# Altium project Audio_testboard.PrjPcb (part 2 of 3)
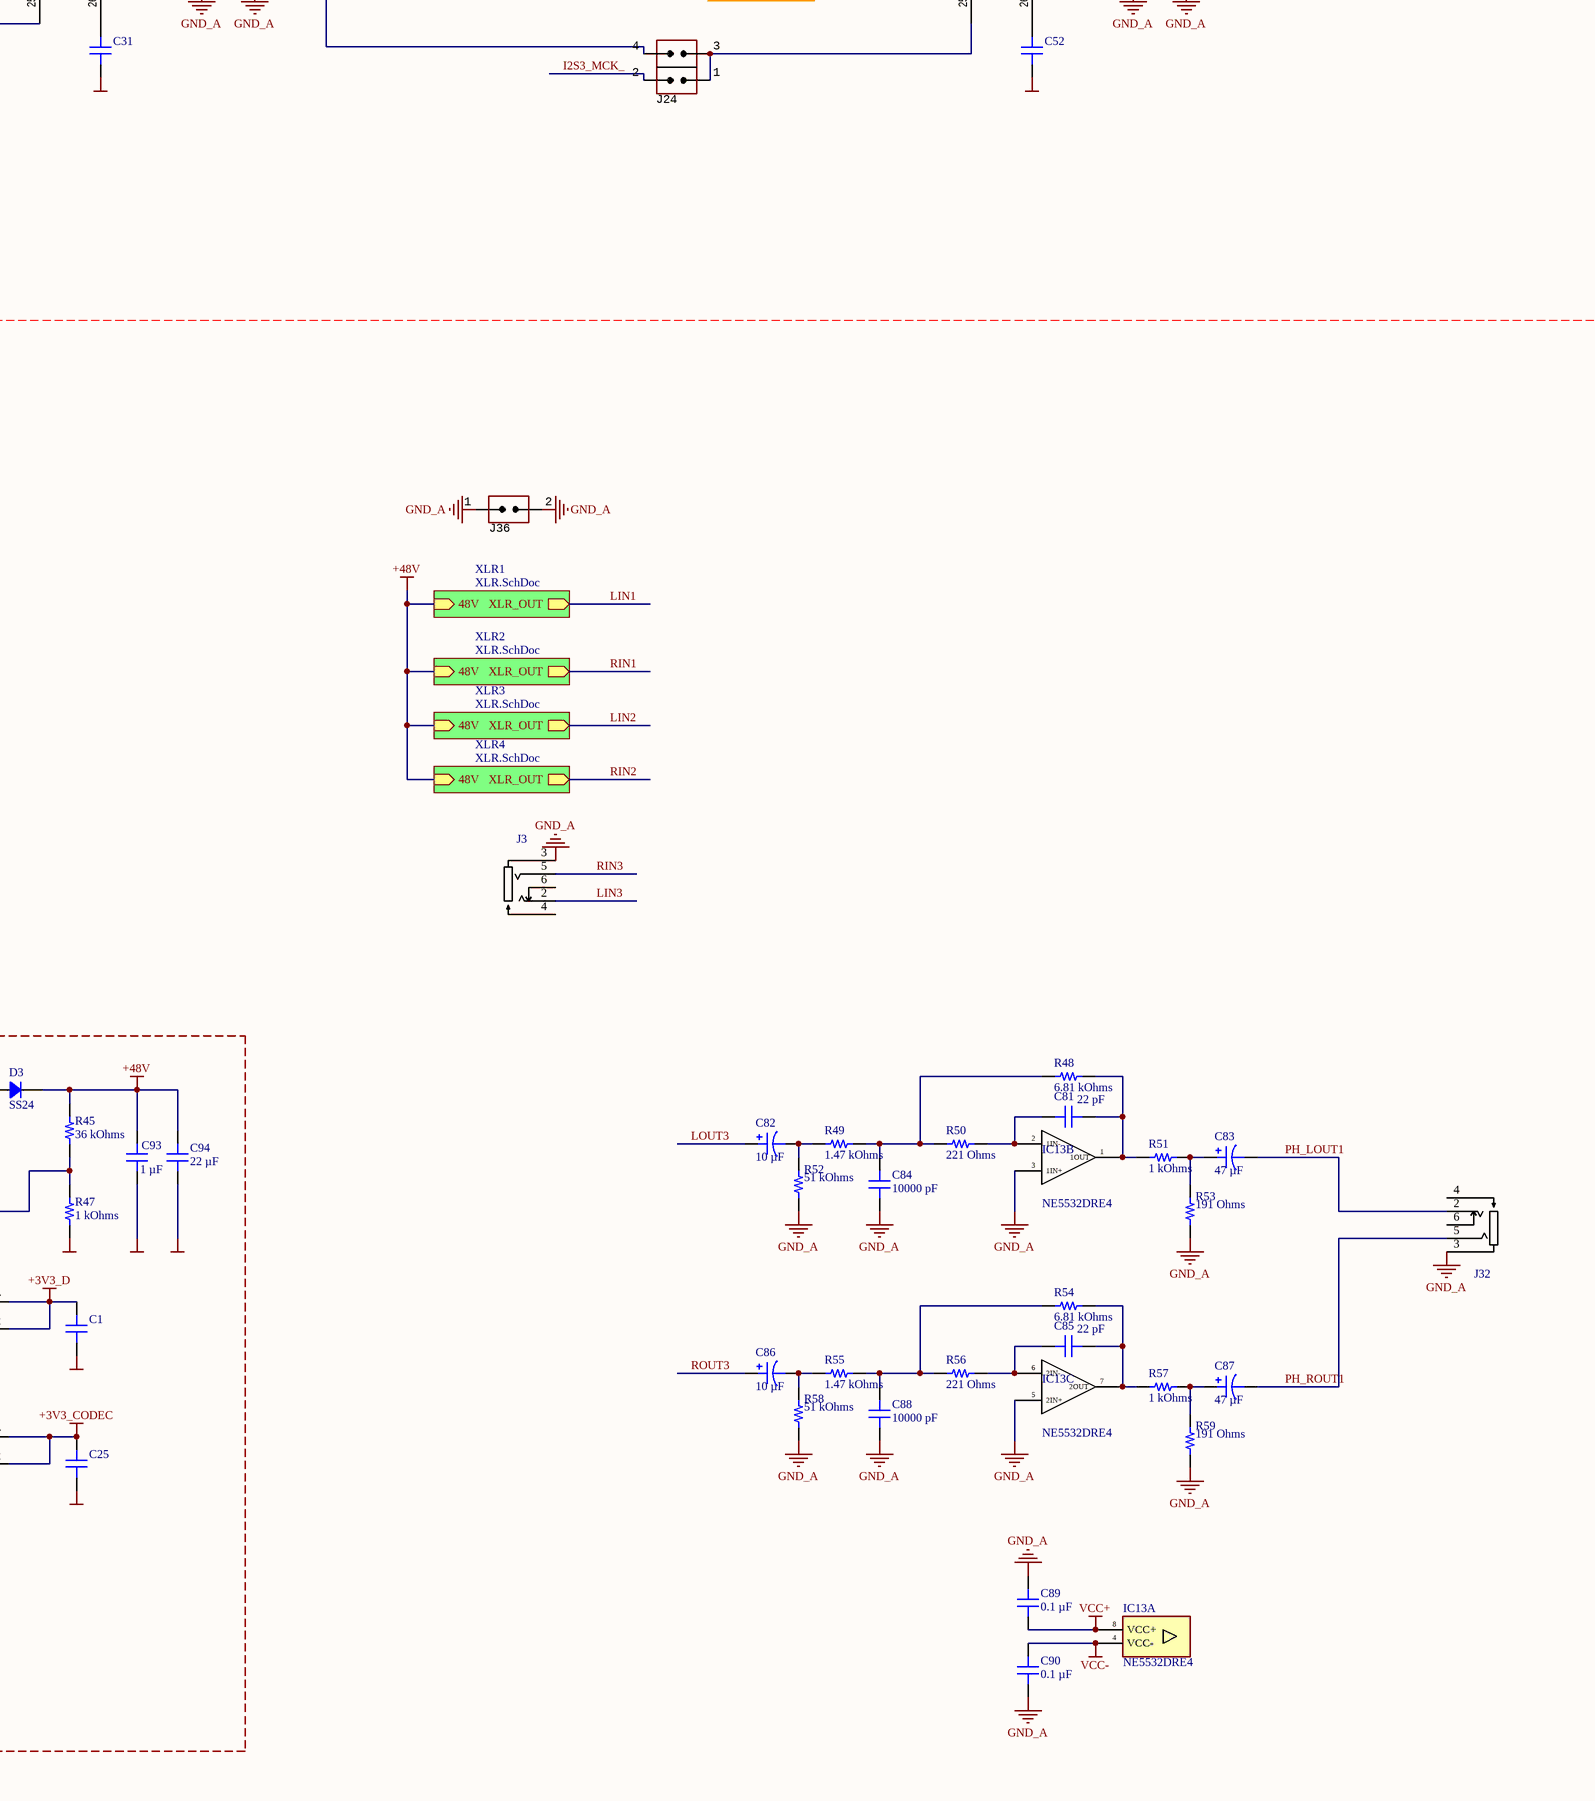
[diagram p7: Audio_testboard.SchDoc, bottom right]

## Sheet Audio_testboard.SchDoc (continued)

### Library data of the parts
C1 C4 C6 C7 C9 C25#2 C28 C30 C41 C42 C51 = LMK212ABJ106KD-T: CAP CER 10UF 10V X5R 0805; manufacturer: Taiyo Yuden; Tolerance: ±10%; Part Number: LMK212ABJ106KD-T; Capacitance: 10 µF; Applications: SMPS Filtering; componentlink1description: Datasheet; componentlink1url: https://www.yuden.co.jp/productdata/catalog/mlcc01_e.pdf; componentlink2description: DigiKey Link; componentlink2url: https://www.digikey.com/en/products/detail/taiyo-yuden/LMK212ABJ106KD-T/4970805; Device Package: 0805 (2012 Metric); lastupdated: 4/6/2026 7:33:15 PM; Lifecycle Status: Active; Minimum Order: 1; Mounting Type: Surface Mount, MLCC; Operating Temperature: -55°C ~ 85°C; Package / Case: 0805 (2012 Metric); packaging: TapeAndReel; partid: 3697; Part Status: Active; price: 0.02; series: M; Size / Dimension: 0.079" L x 0.049" W (2.00mm x 1.25mm); Supplier 1: DigiKey; Supplier Part Number 1: 587-4282-1-ND; Temperature Coefficient: X5R; Thickness (Max): 0.037" (0.95mm); value: 10 µF; Voltage - Rated: 10V
C2 C23#2 = EMK212B7105KGHTR: CAP CER 1UF 16V X7R 0805; manufacturer: Taiyo Yuden; Tolerance: ±10%; Part Number: EMK212B7105KGHTR; Capacitance: 1 µF; Applications: Automotive; componentlink1description: Datasheet; componentlink1url: https://ds.yuden.co.jp/TYCOMPAS/ut/detail?pn=EMK212B7105KGHTR &u=M; componentlink2description: DigiKey Link; componentlink2url: https://www.digikey.com/en/products/detail/taiyo-yuden/EMK212B7105KGHTR/6563155; Device Package: 0805 (2012 Metric); lastupdated: 4/6/2026 7:33:15 PM; Lifecycle Status: Active; Minimum Order: 1; Mounting Type: Surface Mount, MLCC; Operating Temperature: -55°C ~ 125°C; Package / Case: 0805 (2012 Metric); packaging: TapeAndReel; partid: 3641; Part Status: Active; price: 0.02; Ratings: AEC-Q200; series: M; Size / Dimension: 0.079" L x 0.049" W (2.00mm x 1.25mm); Supplier 1: DigiKey; Supplier Part Number 1: 587-6310-1-ND; Temperature Coefficient: X7R; Thickness (Max): 0.053" (1.35mm); value: 1 µF; Voltage - Rated: 16V
C3 C5 C8 C10-C12 C15 C16 C27 C29 C40 C43 C44 C46 C50 = CL05B104JO5NNNC: CAP CER 0.1UF 16V X7R 0402; manufacturer: Samsung Electro-Mechanics; Tolerance: ±5%; Part Number: CL05B104JO5NNNC; Capacitance: 0.1 µF; Applications: General Purpose; componentlink1description: Datasheet; componentlink1url: http://www.samsungsem.com/kr/support/product-search/mlcc/CL05B104JO5NNNC.jsp; componentlink2description: DigiKey Link; componentlink2url: https://www.digikey.com/en/products/detail/samsung-electro-mechanics/CL05B104JO5NNNC/3887163; Device Package: 0402 (1005 Metric); lastupdated: 4/6/2026 7:11:05 PM; Lifecycle Status: Active; Minimum Order: 1; Mounting Type: Surface Mount, MLCC; Operating Temperature: -55°C ~ 125°C; Package / Case: 0402 (1005 Metric); packaging: TapeAndReel; partid: 2761; Part Status: Active; price: 0.01; series: CL; Size / Dimension: 0.039" L x 0.020" W (1.00mm x 0.50mm); Supplier 1: DigiKey; Supplier Part Number 1: 1276-1505-1-ND; Temperature Coefficient: X7R; Thickness (Max): 0.022" (0.55mm); value: 0.1 µF; Voltage - Rated: 16V
C13 C14 C19 C20 C45 C48 = TR3A106K010C2000: CAP TANT 10UF 10% 10V 1206; manufacturer: Vishay Sprague; Manufacturer Size Code: A; ESR (Equivalent Series Resistance): 2Ohm; Type: Molded; Part Number: TR3A106K010C2000; Value: 10 µF; Capacitance: 10 µF; componentlink1description: Datasheet; componentlink1url: http://www.vishay.com/docs/40080/tr3.pdf; componentlink2description: DigiKey Link; componentlink2url: https://www.digikey.com/en/products/detail/vishay-sprague/TR3A106K010C2000/1579435; Device Package: 1206 (3216 Metric); Features: General Purpose; Height - Seated (Max): 0.071" (1.80mm); lastupdated: 4/5/2026 8:12:52 PM; Lifecycle Status: Active; Minimum Order: 1; Mounting Type: Surface Mount; Operating Temperature: -55°C ~ 125°C; Package / Case: 1206 (3216 Metric); packaging: TapeAndReel; partid: 299; Part Status: Active; price: 0.24; series: TANTAMOUNT™, TR3; Size / Dimension: 0.126" L x 0.063" W (3.20mm x 1.60mm); Supplier 1: DigiKey; Supplier Part Number 1: 718-1300-1-ND; Tolerance: ±10%; Voltage - Rated: 10 V
C17 C18 C21 C22 C47 C49 = CC0603JRX7R9BB221: CAP CER 220PF 50V X7R 0603; manufacturer: Yageo; Tolerance: ±5%; Part Number: CC0603JRX7R9BB221; Capacitance: 220 pF; Applications: General Purpose; componentlink1description: Datasheet; componentlink1url: https://www.yageo.com/upload/media/product/productsearch/datasheet/mlcc/UPY-GPHC_X7R_6.3V-to-50V_18.pdf; componentlink2description: DigiKey Link; componentlink2url: https://www.digikey.com/en/products/detail/yageo/CC0603JRX7R9BB221/5883681; Device Package: 0603 (1608 Metric); lastupdated: 4/6/2026 7:23:48 PM; Lifecycle Status: Active; Minimum Order: 1; Mounting Type: Surface Mount, MLCC; Operating Temperature: -55°C ~ 125°C; Package / Case: 0603 (1608 Metric); packaging: TapeAndReel; partid: 3536; Part Status: Active; price: 0.01; series: CC; Size / Dimension: 0.063" L x 0.031" W (1.60mm x 0.80mm); Supplier 1: DigiKey; Supplier Part Number 1: 311-4009-1-ND; Temperature Coefficient: X7R; Thickness (Max): 0.035" (0.90mm); value: 220 pF; Voltage - Rated: 50V
C23#1 C25#1 = T495D476K010ATE090: CAP TANT 47UF 10% 10V 2917; Part Number: T495D476K010ATE090; Value: 47 µF
C24 C26 C34-C39 C53 C54 = 06035C104MAT2A: CAP CER 0.1UF 50V X7R 0603; manufacturer: AVX Corporation; Tolerance: ±20%; Part Number: 06035C104MAT2A; Capacitance: 0.1µF; Applications: General Purpose; componentlink1description: Datasheet; componentlink1url: http://datasheets.avx.com/X7RDielectric.pdf; componentlink2description: DigiKey Link; componentlink2url: http://digikey.com/product-detail/en/avx-corporation/06035C104MAT2A/478-7928-1-ND/3881551; Device Package: 0603 (1608 Metric); lastupdated: 9/2/2020 1:03:35 AM; Lifecycle Status: Active; Minimum Order: 1; Mounting Type: Surface Mount, MLCC; Operating Temperature: -55°C ~ 125°C; Package / Case: 0603 (1608 Metric); packaging: TapeAndReel; partid: 2734; Part Status: Active; price: 0.02; series: -; Size / Dimension: 0.063" L x 0.032" W (1.60mm x 0.81mm); Supplier 1: DigiKey; Supplier Part Number 1: 478-7928-1-ND; Temperature Coefficient: X7R; Thickness (Max): 0.035" (0.90mm); value: 0.1µF; Voltage - Rated: 50V
C31-C33 C52 = CBR08C909BAGAC: CAP CER 9PF 250V C0G/NP0 0805; manufacturer: KEMET; Temperature Coefficient: C0G, NP0; Tolerance: ±0.1pF; Part Number: CBR08C909BAGAC; Capacitance: 9 pF; Applications: RF, Microwave, High Frequency; componentlink1description: Datasheet; componentlink1url: https://api.kemet.com/component-edge/download/datasheet/CBR08C909BAGAC.pdf; componentlink2description: DigiKey Link; componentlink2url: https://www.digikey.com/en/products/detail/kemet/CBR08C909BAGAC/3480238; Device Package: 0805 (2012 Metric); Features: High Q, Low Loss, Ultra Low ESR; lastupdated: 4/6/2026 7:32:40 PM; Lifecycle Status: Active; Minimum Order: 1; Mounting Type: Surface Mount, MLCC; Operating Temperature: -55°C ~ 125°C; Package / Case: 0805 (2012 Metric); packaging: TapeAndReel; partid: 13883; Part Status: Active; price: 0.41; series: CBR-SMD RF C0G; Size / Dimension: 0.079" L x 0.049" W (2.00mm x 1.25mm); Supplier 1: DigiKey; Supplier Part Number 1: 399-8712-1-ND; Thickness (Max): 0.037" (0.95mm); value: 9 pF; Voltage - Rated: 250V
C55-C68 = C0402C104K4RACAUTO: CAP CER 0.1UF 16V X7R 0402; manufacturer: KEMET; Tolerance: ±10%; Part Number: C0402C104K4RACAUTO; value: 0.1 µF; Applications: Automotive, Bypass, Decoupling; Capacitance: 0.1 µF; componentlink1description: Datasheet; componentlink1url: https://api.kemet.com/component-edge/download/specsheet/C0402C104K4RACAUTO.pdf; componentlink2description: DigiKey Link; componentlink2url: https://www.digikey.com/en/products/detail/kemet/C0402C104K4RACAUTO/3314827; Device Package: 0402 (1005 Metric); lastupdated: 4/6/2026 7:11:04 PM; Lifecycle Status: Active; Minimum Order: 1; Mounting Type: Surface Mount, MLCC; Operating Temperature: -55°C ~ 125°C; Package / Case: 0402 (1005 Metric); packaging: TapeAndReel; partid: 3024; Part Status: Active; price: 0.01; Ratings: AEC-Q200; series: SMD Auto X7R; Size / Dimension: 0.039" L x 0.020" W (1.00mm x 0.50mm); Supplier 1: DigiKey; Supplier Part Number 1: 399-6828-1-ND; Temperature Coefficient: X7R; Thickness (Max): 0.022" (0.55mm); Voltage - Rated: 16V
C69 C89 C90 = C0603C104K5RAC7411: CAP CER 0.1UF 50V X7R 0603; manufacturer: KEMET; Tolerance: ±10%; Part Number: C0603C104K5RAC7411; value: 0.1 µF; Applications: Bypass, Decoupling; Capacitance: 0.1 µF; componentlink1description: Datasheet; componentlink1url: https://api.kemet.com/component-edge/download/datasheet/C0603C104K5RAC7411.pdf; componentlink2description: DigiKey Link; componentlink2url: https://www.digikey.com/en/products/detail/kemet/C0603C104K5RAC7411/3317013; Device Package: 0603 (1608 Metric); lastupdated: 4/6/2026 7:23:52 PM; Lifecycle Status: Active; Minimum Order: 1; Mounting Type: Surface Mount, MLCC; Operating Temperature: -55°C ~ 125°C; Package / Case: 0603 (1608 Metric); packaging: TapeAndReel; partid: 2233; Part Status: Active; price: 0.01; series: SMD Comm X7R; Size / Dimension: 0.063" L x 0.031" W (1.60mm x 0.80mm); Supplier 1: DigiKey; Supplier Part Number 1: 399-C0603C104K5RAC7411CT-ND; Temperature Coefficient: X7R; Thickness (Max): 0.035" (0.90mm); Voltage - Rated: 50V
C70 C73 C76 C79 C92 = C0805C106K8PAC7800: CAP CER 10UF 10V X5R 0805; manufacturer: KEMET; Tolerance: ±10%; Part Number: C0805C106K8PAC7800; value: 10 µF; Applications: Bypass, Decoupling; Capacitance: 10 µF; componentlink1description: Datasheet; componentlink1url: https://connect.kemet.com:7667/gateway/IntelliData-ComponentDocumentation/1.0/download/datasheet/C0805C106K8PACTU; componentlink2description: DigiKey Link; componentlink2url: https://www.digikey.com/en/products/detail/kemet/C0805C106K8PAC7800/1090830; Device Package: 0805 (2012 Metric); lastupdated: 4/6/2026 7:31:47 PM; Lifecycle Status: Active; Minimum Order: 1; Mounting Type: Surface Mount, MLCC; Operating Temperature: -55°C ~ 85°C; Package / Case: 0805 (2012 Metric); packaging: TapeAndReel; partid: 44790; Part Status: Active; price: 0.01; series: SMD Comm X5R; Size / Dimension: 0.079" L x 0.049" W (2.00mm x 1.25mm); Supplier 1: DigiKey; Supplier Part Number 1: 399-C0805C106K8PAC7800CT-ND; Temperature Coefficient: X5R; Thickness (Max): 0.055" (1.40mm); Voltage - Rated: 10V
C71 C93 = C0805C105K4RAC7800: CAP CER 1UF 16V X7R 0805; manufacturer: KEMET; Tolerance: ±10%; Part Number: C0805C105K4RAC7800; value: 1 µF; Applications: Bypass, Decoupling; Capacitance: 1 µF; componentlink1description: Datasheet; componentlink1url: https://api.kemet.com/component-edge/download/datasheet/C0805C105K4RACTU.pdf; componentlink2description: DigiKey Link; componentlink2url: https://www.digikey.com/en/products/detail/kemet/C0805C105K4RAC7800/416047; Device Package: 0805 (2012 Metric); lastupdated: 4/6/2026 7:31:58 PM; Lifecycle Status: Active; Minimum Order: 1; Mounting Type: Surface Mount, MLCC; Operating Temperature: -55°C ~ 125°C; Package / Case: 0805 (2012 Metric); packaging: TapeAndReel; partid: 32075; Part Status: Active; price: 0.01; series: SMD Comm X7R; Size / Dimension: 0.079" L x 0.049" W (2.00mm x 1.25mm); Supplier 1: DigiKey; Supplier Part Number 1: 399-C0805C105K4RAC7800CT-ND; Temperature Coefficient: X7R; Thickness (Max): 0.039" (1.00mm); Voltage - Rated: 16V
C72 C74 C75 C77 C78 C80 C91 C95 = TCJB475M025R0150: CAP TANT POLY 4.7UF 25V 1210; manufacturer: AVX Corporation; Manufacturer Size Code: B; ESR (Equivalent Series Resistance): 100mOhm @ 100kHz; Lifetime @ Temp.: 2000 Hrs @ 105°C; Tolerance: ±20%; Type: Molded; Part Number: TCJB475M025R0150; Value: 4.7µF; Capacitance: 4.7µF; componentlink1description: Datasheet; componentlink1url: http://datasheets.avx.com/TCJ.pdf; componentlink2description: DigiKey Link; componentlink2url: http://digikey.com/product-detail/en/avx-corporation/TCJB475M025R0150/478-6630-1-ND/2676432; Features: General Purpose; Height - Seated (Max): 0.083" (2.10mm); lastupdated: 9/2/2020 1:16:39 AM; Lifecycle Status: Active; Minimum Order: 1; Mounting Type: Surface Mount; Operating Temperature: -55°C ~ 105°C; Package / Case: 1411 (3528 Metric), 1210; packaging: TapeAndReel; partid: 1578; Part Status: Active; price: 0.29; series: TCJ; Size / Dimension: 0.138" L x 0.110" W (3.50mm x 2.80mm); Supplier 1: DigiKey; Supplier Part Number 1: 478-6630-1-ND; Voltage - Rated: 25V
C81 C85 = CC0603GRNPO9BN220: CAP CER 22PF 50V C0G/NPO 0603; manufacturer: Yageo; Temperature Coefficient: C0G, NP0; Tolerance: ±2%; Part Number: CC0603GRNPO9BN220; Capacitance: 22 pF; Applications: General Purpose; componentlink1description: Datasheet; componentlink1url: https://www.yageo.com/upload/media/product/productsearch/datasheet/mlcc/UPY-GP_NP0_16V-to-50V_17.pdf; componentlink2description: DigiKey Link; componentlink2url: https://www.digikey.com/en/products/detail/yageo/CC0603GRNPO9BN220/5883550; Device Package: 0603 (1608 Metric); lastupdated: 4/6/2026 7:23:47 PM; Lifecycle Status: Active; Minimum Order: 1; Mounting Type: Surface Mount, MLCC; Operating Temperature: -55°C ~ 125°C; Package / Case: 0603 (1608 Metric); packaging: TapeAndReel; partid: 3677; Part Status: Active; price: 0.01; series: CC; Size / Dimension: 0.063" L x 0.031" W (1.60mm x 0.80mm); Supplier 1: DigiKey; Supplier Part Number 1: 311-3925-1-ND; Thickness (Max): 0.035" (0.90mm); value: 22 pF; Voltage - Rated: 50V
C82 C86 = T491A106K010AT: CAP TANT 10UF 10% 10V 1206; manufacturer: KEMET; Manufacturer Size Code: A; ESR (Equivalent Series Resistance): 3.8Ohm; Lifetime @ Temp.: 2000 Hrs @ 125°C; Type: Molded; Part Number: T491A106K010AT; Value: 10 µF; Capacitance: 10 µF; componentlink1description: Datasheet; componentlink1url: https://api.kemet.com/component-edge/download/datasheet/T491A106K010AT.pdf; componentlink2description: DigiKey Link; componentlink2url: https://www.digikey.com/en/products/detail/kemet/T491A106K010AT/818545; Device Package: 1206 (3216 Metric); Features: General Purpose; Height - Seated (Max): 0.071" (1.80mm); lastupdated: 4/5/2026 8:12:52 PM; Lifecycle Status: Active; Minimum Order: 1; Mounting Type: Surface Mount; Operating Temperature: -55°C ~ 125°C; Package / Case: 1206 (3216 Metric); packaging: TapeAndReel; partid: 330; Part Status: Active; price: 0.09; series: T491; Size / Dimension: 0.126" L x 0.063" W (3.20mm x 1.60mm); Supplier 1: DigiKey; Supplier Part Number 1: 399-3684-1-ND; Tolerance: ±10%; Voltage - Rated: 10 V
C83 C87 = 293D476X9010D2TE3: CAP TANT 47UF 10% 10V 2917; manufacturer: Vishay Sprague; Manufacturer Size Code: D; ESR (Equivalent Series Resistance): 700mOhm; Type: Molded; Part Number: 293D476X9010D2TE3; Value: 47 µF; Capacitance: 47 µF; componentlink1description: Datasheet; componentlink1url: http://www.vishay.com/docs/40002/293d.pdf; componentlink2description: DigiKey Link; componentlink2url: https://www.digikey.com/en/products/detail/vishay-sprague/293D476X9010D2TE3/1559440; Device Package: 2917 (7343 Metric); Features: General Purpose; Height - Seated (Max): 0.122" (3.10mm); lastupdated: 4/5/2026 8:13:50 PM; Lifecycle Status: Active; Minimum Order: 1; Mounting Type: Surface Mount; Operating Temperature: -55°C ~ 125°C; Package / Case: 2917 (7343 Metric); packaging: TapeAndReel; partid: 2778; Part Status: Active; price: 0.19; series: TANTAMOUNT™, 293D; Size / Dimension: 0.287" L x 0.169" W (7.30mm x 4.30mm); Supplier 1: DigiKey; Supplier Part Number 1: 718-1088-1-ND; Tolerance: ±10%; Voltage - Rated: 10 V
C84 C88 = GRM1885C1H103JA01D: CAP CER 10000PF 50V C0G/NP0 0603; manufacturer: Murata Electronics; Temperature Coefficient: C0G, NP0; Tolerance: ±5%; Part Number: GRM1885C1H103JA01D; Capacitance: 10000 pF; Applications: General Purpose; componentlink1description: Datasheet; componentlink1url: https://www.murata.com/~/media/webrenewal/support/library/catalog/products/capacitor/mlcc/c02e.ashx?la=en-us; componentlink2description: DigiKey Link; componentlink2url: https://www.digikey.com/en/products/detail/murata-electronics/GRM1885C1H103JA01D/4421555; Device Package: 0603 (1608 Metric); lastupdated: 4/6/2026 7:23:21 PM; Lifecycle Status: Active; Minimum Order: 1; Mounting Type: Surface Mount, MLCC; Operating Temperature: -55°C ~ 125°C; Package / Case: 0603 (1608 Metric); packaging: TapeAndReel; partid: 11077; Part Status: Active; price: 0.02; series: GRM; Size / Dimension: 0.063" L x 0.031" W (1.60mm x 0.80mm); Supplier 1: DigiKey; Supplier Part Number 1: 490-9666-1-ND; Thickness (Max): 0.035" (0.90mm); value: 10000 pF; Voltage - Rated: 50V
C94 = CC0805MKX5R8BB226: CAP CER 22UF 25V X5R 0805; manufacturer: Yageo; Tolerance: ±20%; Part Number: CC0805MKX5R8BB226; value: 22 µF; Applications: General Purpose; Capacitance: 22 µF; componentlink1description: Datasheet; componentlink1url: https://www.yageo.com/upload/media/product/productsearch/datasheet/mlcc/UPY-GPHC_X5R_4V-to-50V_25.pdf; componentlink2description: DigiKey Link; componentlink2url: https://www.digikey.com/en/products/detail/yageo/CC0805MKX5R8BB226/5195309; Device Package: 0805 (2012 Metric); lastupdated: 4/6/2026 7:32:08 PM; Lifecycle Status: Active; Minimum Order: 1; Mounting Type: Surface Mount, MLCC; Operating Temperature: -55°C ~ 85°C; Package / Case: 0805 (2012 Metric); packaging: TapeAndReel; partid: 39226; Part Status: Active; price: 0.09; series: CC; Size / Dimension: 0.079" L x 0.049" W (2.00mm x 1.25mm); Supplier 1: DigiKey; Supplier Part Number 1: 311-1903-1-ND; Temperature Coefficient: X5R; Thickness (Max): 0.057" (1.45mm); Voltage - Rated: 25V
D3 = SS24: DIODE SCHOTTKY 40V 2A DO214AA; Manufacturer: ON Semiconductor; Current - Reverse Leakage @ Vr: 400µA @ 40V; Speed: Fast Recovery =< 500ns, > 200mA (Io); Voltage - Forward (Vf) (Max) @ If: 500mV @ 2A; Part Number: SS24; ComponentLink1Description: Datasheet; ComponentLink1URL: https://www.onsemi.com/pub/Collateral/SS29-D.pdf; ComponentLink2Description: DigiKey Link; ComponentLink2URL: http://digikey.com/product-detail/en/on-semiconductor/SS24/SS24FSCT-ND/1626273; Current - Average Rectified (Io): 2A; Diode Type: Schottky; LastUpdated: 4/5/2026 8:31:06 PM; Lifecycle Status: Active; Minimum Order: 1; Mounting Type: Surface Mount; Operating Temperature - Junction: -65°C ~ 125°C; Package / Case: DO-214AA, SMB; Packaging: TapeAndReel; PartId: 1394; Part Status: Active; Price: 0.10; Series: -; Supplier 1: DigiKey; Supplier Part Number 1: SS24FSCT-ND; Supplier Device Package: DO-214AA (SMB); Voltage - DC Reverse (Vr) (Max): 40V
IC1 IC7 = ams1117-3.3v: Integrated Circuit; Manufacturer_Name: Advanced Monolithic Systems; Datasheet Link: http://www.advanced-monolithic.com/pdf/ds1117.pdf; Height: 1.8mm; Manufacturer_Part_Number: ams1117-3.3v; Supplier 1: LCSC
IC2-IC6 = ISO7241CDWR: Integrated Circuit; Manufacturer_Name: Texas Instruments; Datasheet Link: http://www.ti.com/lit/gpn/iso7241c; Height: 2.65mm; Manufacturer_Part_Number: ISO7241CDWR; Mouser Part Number: 595-ISO7241CDWR; Mouser Price/Stock: https://www.mouser.co.uk/ProductDetail/Texas-Instruments/ISO7241CDWR?qs=LDGDZb5k%2F%252B%2FseN2cNP%252BcHQ%3D%3D; Arrow Part Number: ISO7241CDWR; Arrow Price/Stock: https://www.arrow.com/en/products/iso7241cdwr/texas-instruments?region=nac
IC8 = N25Q128A13ESE40F: Integrated Circuit; Manufacturer_Name: Micron; Datasheet Link: https://datasheet.datasheetarchive.com/originals/distributors/Datasheets-DGA23/1494983.pdf; Height: 2.16mm; Manufacturer_Part_Number: N25Q128A13ESE40F; Mouser Part Number: 340-182267; Mouser Price/Stock: https://www.mouser.co.uk/ProductDetail/Micron/N25Q128A13ESE40F?qs=taEdVNyAfdHw8xv9Y4zfpQ%3D%3D; Arrow Part Number: N25Q128A13ESE40F; Arrow Price/Stock: https://www.arrow.com/en/products/n25q128a13ese40f/micron-technology
IC9 = LD1117DT33TR: Integrated Circuit; Manufacturer_Name: STMicroelectronics; Datasheet Link: http://www.st.com/web/en/resource/technical/document/datasheet/CD00000544.pdf; Height: 2.4mm; Manufacturer_Part_Number: LD1117DT33TR; Mouser Part Number: 511-LD1117DT33-TR; Mouser Price/Stock: https://www.mouser.co.uk/ProductDetail/STMicroelectronics/LD1117DT33TR?qs=4JhUBQGAOSd4P5jVYGxp2g%3D%3D; Arrow Part Number: LD1117DT33TR; Arrow Price/Stock: https://www.arrow.com/en/products/ld1117dt33tr/stmicroelectronics?region=nac
IC10-IC12 IC14 = B0505S-1W: Mournsun / JGCRYT DC-DC isolated converter module 5v -> 5v 1W
IC13 = NE5532DRE4: Integrated Circuit; Manufacturer_Name: Texas Instruments; Datasheet Link: https://www.ti.com/lit/ds/symlink/ne5532.pdf?HQS=dis-mous-null-mousermode-dsf-pf-null-wwe&ts=1618482303902&ref_url=https%253A%252F%252Fwww.mouser.com%252F; Height: 1.75mm; Manufacturer_Part_Number: NE5532DRE4; Mouser Part Number: 595-NE5532DRE4; Mouser Price/Stock: https://www.mouser.co.uk/ProductDetail/Texas-Instruments/NE5532DRE4?qs=7nS3%252BbEUL6spPf9Rt7S6cg%3D%3D; Arrow Part Number: NE5532DRE4; Arrow Price/Stock: https://www.arrow.com/en/products/ne5532dre4/texas-instruments
J3 J29-J32 J39-J41 J45 = 3.5mm jack stereo smd: Conn 3.5MM Stereo Jack F 3 POS Solder RA SMD 3 Terminal 1 Port T/R PJ-327; MF: Switchcraft; MP: 35RASMT2BHNTRX; Package: None; Price: 0.84 USD; Availability: Good; SnapEDA_Link: https://www.snapeda.com/parts/35RASMT2BHNTRX/Switchcraft%20Inc./view-part/?ref=snap; Value: *
J4-J23 J33-J37 J42 J44 = Jumper_single: CommentText: "Перемычка"
J24 J28 = Jumper_double: CommentText: "Перемычка"
J25-J27 = 20021121-00008T4LF: Connector; Manufacturer_Name: Amphenol Communications Solutions; Datasheet Link: https://cdn.amphenol-cs.com/media/wysiwyg/files/drawing/20021121.pdf; Height: 4.55mm; Manufacturer_Part_Number: 20021121-00008T4LF; System: Connector
J38 = TYPE-C-31-M-12: USB Connectors 24 Receptacle 1 8.94*7.3mm RoHS; MF: {'manufacturer': u'HRO Electronics Co., Ltd.'}; Package: None; Price: None; Value: *; MP: TYPE-C-31-M-12; Availability: Unavailable
L1 = SRR1280-330M: FIXED IND 33UH 3.5A 57 MOHM SMD; Manufacturer: Bourns Inc.; Current - Saturation: 3.3A; DC Resistance (DCR): 57mOhm Max; Frequency - Self Resonant: 9.5MHz; Inductance Frequency - Test: 100 kHz; Material - Core: Ferrite; Q @ Freq: 28 @ 2.52MHz; Shielding: Shielded; Tolerance: ±20%; Type: Drum Core, Wirewound; Part Number: SRR1280-330M; ComponentLink1Description: Datasheet; ComponentLink1URL: https://www.bourns.com/docs/Product-Datasheets/SRR1280.pdf; ComponentLink2Description: DigiKey Link; ComponentLink2URL: https://www.digikey.com/en/products/detail/bourns-inc/SRR1280-330M/1969998; Current Rating (Amps): 3.5 A; Device Package: Nonstandard; Height - Seated (Max): 0.315" (8.00mm); Inductance: 33 µH; LastUpdated: 4/5/2026 8:41:43 PM; Lifecycle Status: Active; Minimum Order: 1; Mounting Type: Surface Mount; Operating Temperature: -40°C ~ 125°C; Package / Case: Nonstandard; Packaging: TapeAndReel; PartId: 25; Part Status: Active; Price: 0.53; Series: SRR1280; Size / Dimension: 0.492" L x 0.492" W (12.50mm x 12.50mm); Supplier 1: DigiKey; Supplier Part Number 1: SRR1280-330MCT-ND; Value: 33 µH
L2-L6 = Inductor_CD54: Aliexpress CD54 type inductor
PS1 = XL6007E1: Power Supply; Manufacturer_Name: XLSEMI; Datasheet Link: http://www.ksmcu.com/pdf/XL6007%20datasheet.pdf; Height: 1.75mm; Manufacturer_Part_Number: XL6007E1
Q1 Q2 = MMBT3904-7-F: TRANS NPN 40V 0.2A SOT-23-3; Manufacturer: Diodes Incorporated; Current - Collector Cutoff (Max): 50nA (ICBO); Current - Collector (Ic) (Max): 200 mA; DC Current Gain (hFE) (Min) @ Ic, Vce: 100 @ 10mA, 1V; Frequency - Transition: 300MHz; Power - Max: 300 mW; Vce Saturation (Max) @ Ib, Ic: 300mV @ 5mA, 50mA; Part Number: MMBT3904-7-F; ComponentLink1Description: Datasheet; ComponentLink1URL: https://www.diodes.com/assets/Datasheets/ds30036.pdf; ComponentLink2Description: DigiKey Link; ComponentLink2URL: https://www.digikey.com/en/products/detail/diodes-incorporated/MMBT3904-7-F/814494; LastUpdated: 4/5/2026 9:03:01 PM; Lifecycle Status: Active; Minimum Order: 1; Mounting Type: Surface Mount; Operating Temperature: -55°C ~ 150°C (TJ); Package / Case: TO-236-3, SC-59, SOT-23-3; Packaging: TapeAndReel; PartId: 85; Part Status: Active; Price: 0.01; Series: -; Supplier 1: DigiKey; Supplier Part Number 1: MMBT3904-FDICT-ND; Supplier Device Package: SOT-23-3; Transistor Type: NPN; Voltage - Collector Emitter Breakdown (Max): 40 V
R1-R8 R17 R18 R37-R40 R42 = RG1608P-562-D-T5: RES SMD 5.6K OHM 0.5% 1/10W 0603; Manufacturer: Susumu; Power (Watts): 0.1W, 1/10W; Temperature Coefficient: ±25ppm/°C; Part Number: RG1608P-562-D-T5; Value: 5.6 kOhms; ComponentLink1Description: Datasheet; ComponentLink1URL: https://www.susumu.co.jp/common/pdf/n_catalog_partition01_en.pdf; ComponentLink2Description: DigiKey Link; ComponentLink2URL: https://www.digikey.com/en/products/detail/susumu/RG1608P-562-D-T5/1262267; Composition: Thin Film; Device Package: 0603 (1608 Metric); Features: Anti-Sulfur, Automotive AEC-Q200; Height - Seated (Max): 0.020" (0.50mm); LastUpdated: 2/9/2024 8:40:32 PM; Lifecycle Status: Active; Minimum Order: 1; Number of Terminations: 2; Operating Temperature: -55°C ~ 155°C; Package / Case: 0603 (1608 Metric); Packaging: TapeAndReel; PartId: 82077; Price: 0.02; Ratings: AEC-Q200; Resistance: 5.6 kOhms; Series: RG; Size / Dimension: 0.063" L x 0.031" W (1.60mm x 0.80mm); Supplier 1: DigiKey; Supplier Part Number 1: 408-RG1608P-562-D-T5CT-ND; Supplier Device Package: 0603; Tolerance: ±0.5%
R9 R13 = RCA060347K0FKEA: RES SMD 47K OHM 1% 1/10W 0603; Part Number: RCA060347K0FKEA; Value: 47 kOhms
R10 R14 R19-R36 = RC0402JR-0722RL: RES 22 OHM 5% 1/16W 0402; Manufacturer: Yageo; Power (Watts): 0.063W, 1/16W; Temperature Coefficient: ±100ppm/°C; Part Number: RC0402JR-0722RL; Value: 22 Ohms; ComponentLink1Description: Datasheet; ComponentLink1URL: https://www.yageo.com/upload/media/product/productsearch/datasheet/rchip/PYu-RC_Group_51_RoHS_L_10.pdf; ComponentLink2Description: DigiKey Link; ComponentLink2URL: https://www.digikey.com/en/products/detail/yageo/RC0402JR-0722RL/726444; Composition: Thick Film; Device Package: 0402 (1005 Metric); Features: Moisture Resistant; Height - Seated (Max): 0.016" (0.40mm); LastUpdated: 4/6/2026 7:41:13 PM; Lifecycle Status: Active; Minimum Order: 1; Number of Terminations: 2; Operating Temperature: -55°C ~ 155°C; Package / Case: 0402 (1005 Metric); Packaging: CutTape; PartId: 7724; Part Status: Active; Price: 0.01; Resistance: 22 Ohms; Series: RC_L; Size / Dimension: 0.039" L x 0.020" W (1.00mm x 0.50mm); Supplier 1: DigiKey; Supplier Part Number 1: 311-22JRCT-ND; Supplier Device Package: 0402; Tolerance: ±5%
R11 R12 R41 = CAY16-33R0F4LF: RES ARRAY 4 RES 33 OHM 1206; Manufacturer: Bourns Inc.; Circuit Type: Isolated; Number of Resistors: 4; Power Per Element: 62.5mW; Resistance (Ohms): 33; Temperature Coefficient: ±200ppm/°C; Tolerance: ±1%; Part Number: CAY16-33R0F4LF; ComponentLink1Description: Datasheet; ComponentLink1URL: https://www.bourns.com/docs/Product-Datasheets/CATCAY.pdf; ComponentLink2Description: DigiKey Link; ComponentLink2URL: http://digikey.com/product-detail/en/bourns-inc/CAY16-33R0F4LF/CAY16-33R0F4LFCT-ND/5774985; Height - Seated (Max): 0.024" (0.60mm); LastUpdated: 9/2/2020 1:23:24 AM; Lifecycle Status: Active; Minimum Order: 1; Mounting Type: Surface Mount; Number of Pins: 8; Operating Temperature: -55°C ~ 125°C; Package / Case: 1206 (3216 Metric), Convex, Long Side Terminals; Packaging: TapeAndReel; PartId: 129; Part Status: Active; Price: 0.01; Series: CAY16; Size / Dimension: 0.126" L x 0.063" W (3.20mm x 1.60mm); Supplier 1: DigiKey; Supplier Part Number 1: CAY16-33R0F4LFCT-ND; Supplier Device Package: 1206
R15 R16 = RCA0402100RFKED: RES SMD 100 OHM 1% 1/16W 0402; Manufacturer: Vishay Dale; Power (Watts): 0.063W, 1/16W; Temperature Coefficient: ±100ppm/°C; Part Number: RCA0402100RFKED; Value: 100 Ohms; ComponentLink1Description: Datasheet; ComponentLink1URL: http://www.vishay.com/docs/20037/rcae3.pdf; ComponentLink2Description: DigiKey Link; ComponentLink2URL: https://www.digikey.com/en/products/detail/vishay-dale/RCA0402100RFKED/4946746; Composition: Thick Film; Device Package: 0402 (1005 Metric); Features: Anti-Sulfur, Automotive AEC-Q200; Height - Seated (Max): 0.016" (0.40mm); LastUpdated: 2/9/2024 8:30:21 PM; Lifecycle Status: Active; Minimum Order: 1; Number of Terminations: 2; Operating Temperature: -55°C ~ 155°C; Package / Case: 0402 (1005 Metric); Packaging: TapeAndReel; PartId: 3179; Part Status: Active; Price: 0.01; Ratings: AEC-Q200; Resistance: 100 Ohms; Series: RCA; Size / Dimension: 0.039" L x 0.020" W (1.00mm x 0.50mm); Supplier 1: DigiKey; Supplier Part Number 1: 541-2177-1-ND; Supplier Device Package: 0402; Tolerance: ±1%
R43 R44 R106 R107 R109 = ERJ-3EKF1002V: RES SMD 10K OHM 1% 1/10W 0603; Manufacturer: Panasonic Electronic Components; Power (Watts): 0.1W, 1/10W; Temperature Coefficient: ±100ppm/°C; Part Number: ERJ-3EKF1002V; Value: 10 kOhms; ComponentLink1Description: Datasheet; ComponentLink1URL: https://industrial.panasonic.com/cdbs/www-data/pdf/RDA0000/AOA0000C304.pdf; ComponentLink2Description: DigiKey Link; ComponentLink2URL: https://www.digikey.com/en/products/detail/panasonic-electronic-components/ERJ-3EKF1002V/196066; Composition: Thick Film; Device Package: 0603 (1608 Metric); Height - Seated (Max): 0.022" (0.55mm); LastUpdated: 2/9/2024 8:41:59 PM; Lifecycle Status: Active; Minimum Order: 1; Number of Terminations: 2; Operating Temperature: -55°C ~ 155°C; Package / Case: 0603 (1608 Metric); Packaging: TapeAndReel; PartId: 25695; Part Status: Active; Price: 0.01; Resistance: 10 kOhms; Series: ERJ-3EK; Size / Dimension: 0.063" L x 0.031" W (1.60mm x 0.80mm); Supplier 1: DigiKey; Supplier Part Number 1: P10.0KHCT-ND; Supplier Device Package: 0603; Tolerance: ±1%; Features: Automotive AEC-Q200; Ratings: AEC-Q200
R45 = AC0603FR-0736KL: RES SMD 36K OHM 1% 1/10W 0603; Manufacturer: Yageo; Power (Watts): 0.1W, 1/10W; Temperature Coefficient: ±100ppm/°C; Part Number: AC0603FR-0736KL; Value: 36 kOhms; ComponentLink1Description: Datasheet; ComponentLink1URL: https://www.yageo.com/upload/media/product/productsearch/datasheet/rchip/PYu-AC_51_RoHS_L_8.pdf; ComponentLink2Description: DigiKey Link; ComponentLink2URL: https://www.digikey.com/en/products/detail/yageo/AC0603FR-0736KL/5896061; Composition: Thick Film; Device Package: 0603 (1608 Metric); Features: Automotive AEC-Q200, Moisture Resistant; Height - Seated (Max): 0.022" (0.55mm); LastUpdated: 4/6/2026 7:43:28 PM; Lifecycle Status: Active; Minimum Order: 1; Number of Terminations: 2; Operating Temperature: -55°C ~ 155°C; Package / Case: 0603 (1608 Metric); Packaging: TapeAndReel; PartId: 67632; Part Status: Active; Price: 0.01; Ratings: AEC-Q200; Resistance: 36 kOhms; Series: AC; Size / Dimension: 0.063" L x 0.031" W (1.60mm x 0.80mm); Supplier 1: DigiKey; Supplier Part Number 1: 13-AC0603FR-0736KLCT-ND; Supplier Device Package: 0603; Tolerance: ±1%
R46 R47 R51 R57 R60-R62 = RCA06031K00FKEA: RES SMD 1K OHM 1% 1/10W 0603; Manufacturer: Vishay Dale; Power (Watts): 0.1W, 1/10W; Temperature Coefficient: ±100ppm/°C; Part Number: RCA06031K00FKEA; Value: 1 kOhms; ComponentLink1Description: Datasheet; ComponentLink1URL: http://www.vishay.com/docs/20037/rcae3.pdf; ComponentLink2Description: DigiKey Link; ComponentLink2URL: https://www.digikey.com/en/products/detail/vishay-dale/RCA06031K00FKEA/4946768; Composition: Thick Film; Device Package: 0603 (1608 Metric); Features: Anti-Sulfur, Automotive AEC-Q200; Height - Seated (Max): 0.020" (0.50mm); LastUpdated: 2/9/2024 8:43:33 PM; Lifecycle Status: Active; Minimum Order: 1; Number of Terminations: 2; Operating Temperature: -55°C ~ 155°C; Package / Case: 0603 (1608 Metric); Packaging: TapeAndReel; PartId: 5741; Part Status: Active; Price: 0.01; Ratings: AEC-Q200; Resistance: 1 kOhms; Series: RCA; Size / Dimension: 0.061" L x 0.033" W (1.55mm x 0.85mm); Supplier 1: DigiKey; Supplier Part Number 1: 541-2199-1-ND; Supplier Device Package: 0603; Tolerance: ±1%
R48 R54 = AC0603FR-076K81L: RES SMD 6.81K OHM 1% 1/10W 0603; Manufacturer: Yageo; Power (Watts): 0.1W, 1/10W; Temperature Coefficient: ±100ppm/°C; Part Number: AC0603FR-076K81L; Value: 6.81 kOhms; ComponentLink1Description: Datasheet; ComponentLink1URL: https://www.yageo.com/upload/media/product/productsearch/datasheet/rchip/PYu-AC_51_RoHS_L_7.pdf; ComponentLink2Description: DigiKey Link; ComponentLink2URL: https://www.digikey.com/en/products/detail/yageo/AC0603FR-076K81L/5896265; Composition: Thick Film; Device Package: 0603 (1608 Metric); Features: Automotive AEC-Q200, Moisture Resistant; Height - Seated (Max): 0.022" (0.55mm); LastUpdated: 4/6/2026 7:43:54 PM; Lifecycle Status: Active; Minimum Order: 1; Number of Terminations: 2; Operating Temperature: -55°C ~ 155°C; Package / Case: 0603 (1608 Metric); Packaging: TapeAndReel; PartId: 11704; Part Status: Active; Price: 0.01; Ratings: AEC-Q200; Resistance: 6.81 kOhms; Series: AC; Size / Dimension: 0.063" L x 0.031" W (1.60mm x 0.80mm); Supplier 1: DigiKey; Supplier Part Number 1: YAG3626CT-ND; Supplier Device Package: 0603; Tolerance: ±1%
R49 R55 = AC0603FR-071K47L: RES SMD 1.47K OHM 1% 1/10W 0603; Manufacturer: Yageo; Power (Watts): 0.1W, 1/10W; Temperature Coefficient: ±100ppm/°C; Part Number: AC0603FR-071K47L; Value: 1.47 kOhms; ComponentLink1Description: Datasheet; ComponentLink1URL: https://www.yageo.com/upload/media/product/productsearch/datasheet/rchip/PYu-AC_51_RoHS_L_8.pdf; ComponentLink2Description: DigiKey Link; ComponentLink2URL: https://www.digikey.com/en/products/detail/yageo/AC0603FR-071K47L/5895863; Composition: Thick Film; Device Package: 0603 (1608 Metric); Features: Automotive AEC-Q200, Moisture Resistant; Height - Seated (Max): 0.022" (0.55mm); LastUpdated: 4/6/2026 7:43:31 PM; Lifecycle Status: Active; Minimum Order: 1; Number of Terminations: 2; Operating Temperature: -55°C ~ 155°C; Package / Case: 0603 (1608 Metric); Packaging: CutTape; PartId: 65725; Part Status: Active; Price: 0.01; Ratings: AEC-Q200; Resistance: 1.47 kOhms; Series: AC; Size / Dimension: 0.063" L x 0.031" W (1.60mm x 0.80mm); Supplier 1: DigiKey; Supplier Part Number 1: 13-AC0603FR-071K47LCT-ND; Supplier Device Package: 0603; Tolerance: ±1%
R50 R56 = AC0603FR-07221RL: RES SMD 221 OHM 1% 1/10W 0603; Manufacturer: Yageo; Power (Watts): 0.1W, 1/10W; Temperature Coefficient: ±100ppm/°C; Part Number: AC0603FR-07221RL; Value: 221 Ohms; ComponentLink1Description: Datasheet; ComponentLink1URL: https://www.yageo.com/upload/media/product/productsearch/datasheet/rchip/PYu-AC_51_RoHS_L_10.pdf; ComponentLink2Description: DigiKey Link; ComponentLink2URL: https://www.digikey.com/en/products/detail/yageo/AC0603FR-07221RL/5895921; Composition: Thick Film; Device Package: 0603 (1608 Metric); Features: Automotive AEC-Q200, Moisture Resistant; Height - Seated (Max): 0.022" (0.55mm); LastUpdated: 4/6/2026 7:43:16 PM; Lifecycle Status: Active; Minimum Order: 1; Number of Terminations: 2; Operating Temperature: -55°C ~ 155°C; Package / Case: 0603 (1608 Metric); Packaging: CutTape; PartId: 87217; Price: 0.01; Ratings: AEC-Q200; Resistance: 221 Ohms; Series: AC; Size / Dimension: 0.063" L x 0.031" W (1.60mm x 0.80mm); Supplier 1: DigiKey; Supplier Part Number 1: 13-AC0603FR-07221RLCT-ND; Supplier Device Package: 0603; Tolerance: ±1%
R52 R58 = AC0603FR-0751KL: RES SMD 51K OHM 1% 1/10W 0603; Manufacturer: Yageo; Power (Watts): 0.1W, 1/10W; Temperature Coefficient: ±100ppm/°C; Part Number: AC0603FR-0751KL; Value: 51 kOhms; ComponentLink1Description: Datasheet; ComponentLink1URL: https://www.yageo.com/upload/media/product/productsearch/datasheet/rchip/PYu-AC_51_RoHS_L_7.pdf; ComponentLink2Description: DigiKey Link; ComponentLink2URL: https://www.digikey.com/en/products/detail/yageo/AC0603FR-0751KL/5896179; Composition: Thick Film; Device Package: 0603 (1608 Metric); Features: Automotive AEC-Q200, Moisture Resistant; Height - Seated (Max): 0.022" (0.55mm); LastUpdated: 4/6/2026 7:43:48 PM; Lifecycle Status: Active; Minimum Order: 1; Number of Terminations: 2; Operating Temperature: -55°C ~ 155°C; Package / Case: 0603 (1608 Metric); Packaging: CutTape; PartId: 17419; Part Status: Active; Price: 0.01; Ratings: AEC-Q200; Resistance: 51 kOhms; Series: AC; Size / Dimension: 0.063" L x 0.031" W (1.60mm x 0.80mm); Supplier 1: DigiKey; Supplier Part Number 1: YAG3616CT-ND; Supplier Device Package: 0603; Tolerance: ±1%
R53 R59 = AC0603FR-07191RL: RES SMD 191 OHM 1% 1/10W 0603; Manufacturer: Yageo; Power (Watts): 0.1W, 1/10W; Temperature Coefficient: ±100ppm/°C; Part Number: AC0603FR-07191RL; Value: 191 Ohms; ComponentLink1Description: Datasheet; ComponentLink1URL: https://www.yageo.com/upload/media/product/productsearch/datasheet/rchip/PYu-AC_51_RoHS_L_9.pdf; ComponentLink2Description: DigiKey Link; ComponentLink2URL: https://www.digikey.com/en/products/detail/yageo/AC0603FR-07191RL/5895841; Composition: Thick Film; Device Package: 0603 (1608 Metric); Features: Automotive AEC-Q200, Moisture Resistant; Height - Seated (Max): 0.022" (0.55mm); LastUpdated: 4/6/2026 7:43:26 PM; Lifecycle Status: Active; Minimum Order: 1; Number of Terminations: 2; Operating Temperature: -55°C ~ 155°C; Package / Case: 0603 (1608 Metric); Packaging: TapeAndReel; PartId: 72108; Part Status: Active; Price: 0.01; Ratings: AEC-Q200; Resistance: 191 Ohms; Series: AC; Size / Dimension: 0.063" L x 0.031" W (1.60mm x 0.80mm); Supplier 1: DigiKey; Supplier Part Number 1: 13-AC0603FR-07191RLCT-ND; Supplier Device Package: 0603; Tolerance: ±1%
TP1 = TestPoint
U1-U3 = WM8731: Stero in/ot audio codec
U6 U7 = SN74LVC1G08DBVR: 1-ch, 2-input 1.65-V to 5.5-V 32 mA drive strength AND gate; MF: Texas Instruments; SnapEDA_Link: https://www.snapeda.com/parts/SN74LVC1G08DBVR/Texas+Instruments/view-part/?ref=snap; Package: SOT-23-5 Texas Instruments; Value: *; MP: SN74LVC1G08DBVR; Check_prices: https://www.snapeda.com/parts/SN74LVC1G08DBVR/Texas+Instruments/view-part/?ref=eda
X1-X8 = PBD-20: Manufacturer: Connfly; ValueManufacturerPartNumber: Connector, 20pin, 2.54mm, 500VAC, 3A; TypeConnector: Connector; VoltageMax: 500VAC; Pitch: 2.54mm; CurrentMax: 3A; Multichannel: 20pin; CommentText: "Разъем"; HelpURL: https://www.chipdip.ru/product/pbd-20; PartNumber: PBD-20
X9 X11 X12 X15 = PLS-2: Manufacturer: Connfly; ValueManufacturerPartNumber: Connector, 2pin, 2.54mm, 500VAC, 3A; TypeConnector: Connector; VoltageMax: 500VAC; Pitch: 2.54mm; CurrentMax: 3A; Multichannel: 2pin; CommentText: "Разъем"; HelpURL: https://www.chipdip.ru/product/pls-2; PartNumber: PLS-2
X10 X13 X14 = PLD-8: Manufacturer: Connfly; ValueManufacturerPartNumber: Connector, 8pin, 2.54mm, 500VAC, 3A; TypeConnector: Connector; VoltageMax: 500VAC; Pitch: 2.54mm; CurrentMax: 3A; Multichannel: 8pin; CommentText: "Разъем"; HelpURL: https://www.chipdip.ru/product/pld-8-ds1021-2x4; PartNumber: PLD-8
Y1 = ABM8G-24.576MHZ-4Y-T3: CRYSTAL 24.5760MHZ 10PF SMD; Manufacturer: Abracon LLC; ESR (Equivalent Series Resistance): 60 Ohms; Frequency Stability: ±30ppm; Operating Mode: Fundamental; Part Number: ABM8G-24.576MHZ-4Y-T3; ComponentLink1Description: Datasheet; ComponentLink1URL: https://abracon.com/Resonators/ABM8G.pdf; ComponentLink2Description: DigiKey Link; ComponentLink2URL: http://digikey.com/product-detail/en/abracon-llc/ABM8G-24.576MHZ-4Y-T3/535-10914-1-ND/2624247; Device Package: 4-SMD, No Lead; Frequency: 24.576MHz; Frequency Tolerance: ±30ppm; Height - Seated (Max): 0.039" (1.00mm); LastUpdated: 3/19/2020 10:36:25 PM; Lifecycle Status: Active; Load Capacitance: 10pF; Minimum Order: 1; Mounting Type: Surface Mount; Operating Temperature: -10°C ~ 60°C; Package / Case: 4-SMD, No Lead; Packaging: TapeAndReel; PartId: 366; Part Status: Active; Price: 0.39; Series: ABM8G; Size / Dimension: 0.126" L x 0.098" W (3.20mm x 2.50mm); Supplier 1: DigiKey; Supplier Part Number 1: 535-10914-1-ND; Type: MHz Crystal; Value: 24.576MHz